# EAGLE design Diversity (EAGLE 6.4)
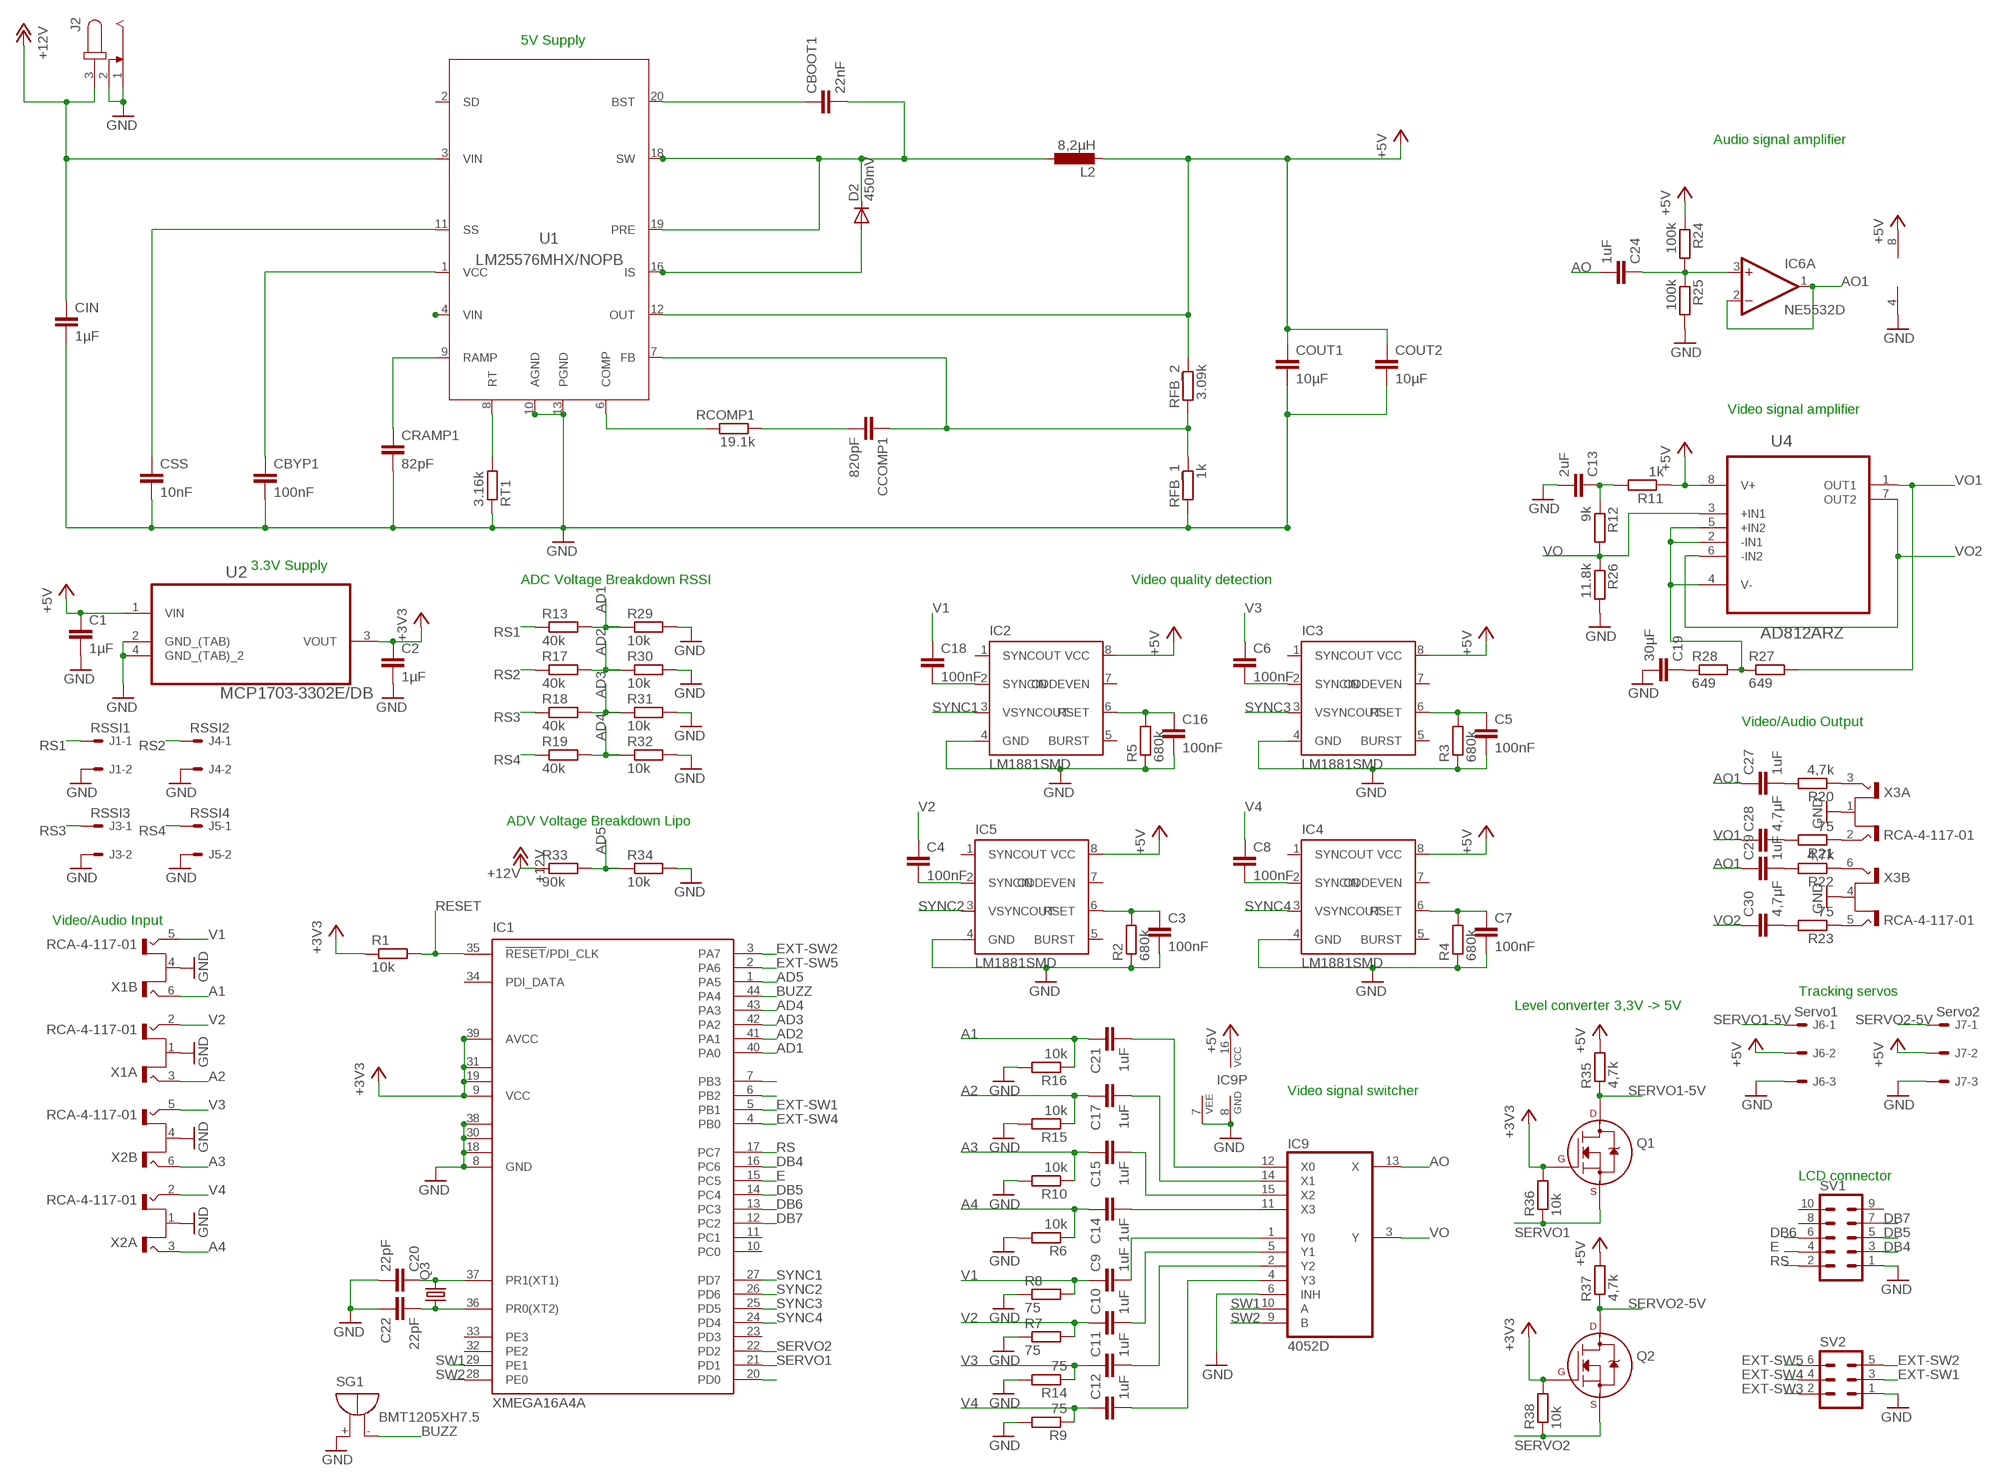
[diagram p0: schematic, sheet 1]

## Parts
C1  1µF  C-EUC0805  [C0805]
C2  1µF  C-EUC0805  [C0805]
C3  100nF  C-EUC0805  [C0805]
C4  100nF  C-EUC0805  [C0805]
C5  100nF  C-EUC0805  [C0805]
C6  100nF  C-EUC0805  [C0805]
C7  100nF  C-EUC0805  [C0805]
C8  100nF  C-EUC0805  [C0805]
C9  1uF  C-EUC0805  [C0805]
C10  1uF  C-EUC0805  [C0805]
C11  1uF  C-EUC0805  [C0805]
C12  1uF  C-EUC0805  [C0805]
C13  2uF  C-EUC0805  [C0805]
C14  1uF  C-EUC0805  [C0805]
C15  1uF  C-EUC0805  [C0805]
C16  100nF  C-EUC0805  [C0805]
C17  1uF  C-EUC0805  [C0805]
C18  100nF  C-EUC0805  [C0805]
C19  30µF  C-EUC0805  [C0805]
C20  22pF  C-EUC0805  [C0805]
C21  1uF  C-EUC0805  [C0805]
C22  22pF  C-EUC0805  [C0805]
C24  1uF  C-EUC0805  [C0805]
C27  1uF  C-EUC0805  [C0805]
C28  4,7µF  C-EUC0805  [C0805]
C29  1uF  C-EUC0805  [C0805]
C30  4,7µF  C-EUC0805  [C0805]
CBOOT1  22nF  C-EUC0805  [C0805]
CBYP1  100nF  C-EUC0805  [C0805]
CCOMP1  820pF  C-EUC0805  [C0805]
CIN  1µF  C-EUC0805  [C0805]
COUT1  10µF  C-EUC0805  [C0805]
COUT2  10µF  C-EUC0805  [C0805]
CRAMP1  82pF  C-EUC0805  [C0805]
CSS  10nF  C-EUC0805  [C0805]
D2  450mV  DIODE-DO214AC  [DO214AC]
IC1  XMEGA16A4A  [TQFP44]
IC2  LM1881SMD  [SOIC08]
IC3  LM1881SMD  [SOIC08]
IC4  LM1881SMD  [SOIC08]
IC5  LM1881SMD  [SOIC08]
IC6  NE5532D  [SO08]
IC9  4052D  [SO16]
J1  RSSI1  22-05-7028-02  [7395-02]
J2  JACK-PLUG0  [SPC4077]
J3  RSSI3  22-05-7028-02  [7395-02]
J4  RSSI2  22-05-7028-02  [7395-02]
J5  RSSI4  22-05-7028-02  [7395-02]
J6  Servo1  22-05-7038-03  [7395-03]
J7  Servo2  22-05-7038-03  [7395-03]
L2  8,2µH  L-EUFPS  [FPS]
Q1  2N7002_SOT23  [SOT-23]
Q2  2N7002_SOT23  [SOT-23]
Q3  CRYSTALHC49UP  [HC49UP]
R1  10k  R-EU_R0805  [R0805@1]
R2  680k  R-EU_R0805  [R0805]
R3  680k  R-EU_R0805  [R0805]
R4  680k  R-EU_R0805  [R0805]
R5  680k  R-EU_R0805  [R0805]
R6  10k  R-EU_M0805  [M0805]
R7  75  R-EU_M0805  [M0805]
R8  75  R-EU_M0805  [M0805]
R9  75  R-EU_M0805  [M0805]
R10  10k  R-EU_M0805  [M0805]
R11  1k  R-EU_R0805  [R0805]
R12  9k  R-EU_R0805  [R0805]
R13  40k  R-EU_R0805  [R0805@1]
R14  75  R-EU_M0805  [M0805]
R15  10k  R-EU_M0805  [M0805]
R16  10k  R-EU_M0805  [M0805]
R17  40k  R-EU_R0805  [R0805@1]
R18  40k  R-EU_R0805  [R0805@1]
R19  40k  R-EU_R0805  [R0805@1]
R20  4,7k  R-EU_R0805  [R0805]
R21  75  R-EU_R0805  [R0805]
R22  4,7k  R-EU_R0805  [R0805]
R23  75  R-EU_R0805  [R0805]
R24  100k  R-EU_R0805  [R0805]
R25  100k  R-EU_R0805  [R0805]
R26  11.8k  R-EU_R0805  [R0805]
R27  649  R-EU_R0805  [R0805]
R28  649  R-EU_R0805  [R0805]
R29  10k  R-EU_R0805  [R0805@1]
R30  10k  R-EU_R0805  [R0805@1]
R31  10k  R-EU_R0805  [R0805@1]
R32  10k  R-EU_R0805  [R0805@1]
R33  90k  R-EU_R0805  [R0805@1]
R34  10k  R-EU_R0805  [R0805@1]
R35  4,7k  R-EU_R0805  [R0805]
R36  10k  R-EU_R0805  [R0805]
R37  4,7k  R-EU_R0805  [R0805]
R38  10k  R-EU_R0805  [R0805]
RCOMP1  19.1k  R-EU_R0805  [R0805]
RFB_1  1k  R-EU_R0805  [R0805]
RFB_2  3.09k  R-EU_R0805  [R0805]
RT1  3.16k  R-EU_R0805  [R0805]
SG1  BMT1205XH7.5  [BMT1205XH7.5]
SV1  ML10  [ML10]
SV2  ML6  [ML6]
U1  LM25576MHX/NOPB  LM25576MHX/NOPBLM25576MHX/NOPB  [MXA20A]
U2  MCP1703-3302E/DB  [SOT230P700X180-4N]
U4  AD812ARZ  [SOIC127P600X175-8N]
X1  RCA-4-117-01  [RCA-4-117-01]
X2  RCA-4-117-01  [RCA-4-117-01]
X3  RCA-4-117-01  [RCA-4-117-01]

## Nets
1: CSS.1 U1.11(SS)
2: CBYP1.1 U1.1(VCC)
3: CRAMP1.1 U1.9(RAMP)
5: RCOMP1.2 U1.6(COMP)
6: CCOMP1.1 RFB_1.1 RFB_2.2 U1.7(FB)
7: CBOOT1.2 D2.C L2.P$1 U1.17(SW) U1.18(SW) U1.19(PRE)
8: D2.A U1.15(IS) U1.16(IS)
11: CBOOT1.1 U1.20(BST)
12: CCOMP1.2 RCOMP1.1
+3V3: C2.1 IC1.9(VCC) IC1.19(VCC1) IC1.31(VCC2) IC1.39(AVCC) Q1.1(G) Q2.1(G) R1.1 R36.2 R38.2 U2.3(VOUT)
+5V: C1.1 COUT1.1 COUT2.1 IC2.8(VCC) IC3.8(VCC) IC4.8(VCC) IC5.8(VCC) IC6.8(P:V+) IC9.16(VCC) J6.2 J7.2 L2.P$2 R11.1 R24.1 R35.2 R37.2 RFB_2.1 U1.12(OUT) U2.1(VIN) U4.8(V+)
+12V: CIN.1 J2.3 R33.1 U1.3(VIN)
A1: C21.1 R16.1 X1.6(B:T2)
A2: C17.1 R15.1 X1.3(A:T2)
A3: C15.1 R10.1 X2.6(B:T2)
A4: C14.1 R6.1 X2.3(A:T2)
AD1: IC1.40(PA0) R13.2 R29.1
AD2: IC1.41(PA1) R17.2 R30.1
AD3: IC1.42(PA2) R18.2 R31.1
AD4: IC1.43(PA3) R19.2 R32.1
AD5: IC1.1(PA5) R33.2 R34.1
AO: C24.2 IC9.13(X)
AO1: C27.1 C29.1 IC6.1(A:OUT) IC6.2(A:-IN)
BUZZ: IC1.44(PA4) SG1.-
DB4: IC1.16(PC6) SV1.3
DB5: IC1.14(PC4) SV1.5
DB6: IC1.13(PC3) SV1.6
DB7: IC1.12(PC2) SV1.7
E: IC1.15(PC5) SV1.4
EXT-SW1: IC1.5(PB1) SV2.3
EXT-SW2: IC1.3(PA7) SV2.5
EXT-SW3: IC1.6(PB2) SV2.2
EXT-SW4: IC1.4(PB0) SV2.4
EXT-SW5: IC1.2(PA6) SV2.6
GND: C1.2 C2.2 C13.2 C19.2 C20.2 C22.1 CBYP1.2 CIN.2 COUT1.2 COUT2.2 CRAMP1.2 CSS.2 IC1.8(GND) IC1.18(GND1) IC1.30(GND2) IC1.38(GND3) IC6.4(P:V-) IC9.6(INH) IC9.7(VEE) IC9.8(GND) J1.2 J2.1 J2.2 J3.2 J4.2 J5.2 J6.3 J7.3 R6.2 R7.1 R8.1 R9.2 R10.2 R14.2 R15.2 R16.2 R25.2 R26.2 R29.2 R30.2 R31.2 R32.2 R34.2 RFB_1.2 RT1.1 SG1.+ SV1.1 SV2.1 U1.10(AGND) U1.13(PGND) U1.14(PGND) U1.21(DAP) U2.2(GND_(TAB)) U2.4(GND_(TAB)_2) X1.1(A:S) X1.4(B:S) X2.1(A:S) X2.4(B:S) X3.1(A:S) X3.4(B:S)
GND1: C3.2 C5.2 C7.2 C16.2 IC2.4(GND) IC3.4(GND) IC4.4(GND) IC5.4(GND) R2.1 R3.1 R4.1 R5.1 ; supply symbol labelled GND
N$1: U1.4(VIN) U1.5(SYNC)
N$2: RT1.2 U1.8(RT)
N$3: C20.1 IC1.37(PR1(XT1)) Q3.2
N$4: C3.1 IC5.6(RSET) R2.2
N$5: C4.2 IC5.2(SYNCIN)
N$6: C5.1 IC3.6(RSET) R3.2
N$7: C6.2 IC3.2(SYNCIN)
N$8: C7.1 IC4.6(RSET) R4.2
N$9: C8.2 IC4.2(SYNCIN)
N$10: C15.2 IC9.15(X2)
N$11: C17.2 IC9.14(X1)
N$12: C9.2 IC9.1(Y0)
N$13: C11.2 IC9.2(Y2)
N$14: C10.2 IC9.5(Y1)
N$15: C21.2 IC9.12(X0)
N$16: C22.2 IC1.36(PR0(XT2)) Q3.1
N$17: C16.1 IC2.6(RSET) R5.2
N$18: C13.1 R11.2 R12.1
N$19: R27.1 R28.2 U4.2(-IN1) U4.4(V-) U4.5(+IN2)
N$22: C18.2 IC2.2(SYNCIN)
N$23: C19.1 R28.1
N$24: IC1.7(PB3)
N$25: C12.2 IC9.4(Y3)
N$28: C14.2 IC9.11(X3)
N$29: IC1.20(PD0)
N$39: R20.1 X3.3(A:T2)
N$40: R21.1 X3.2(A:T1)
N$41: R22.1 X3.6(B:T2)
N$42: R23.1 X3.5(B:T1)
N$43: C27.2 R20.2
N$44: C28.2 R21.2
N$45: C29.2 R22.2
N$46: C30.2 R23.2
N$47: C24.1 IC6.3(A:+IN) R24.2 R25.1
RESET: IC1.35(!RESET!/PDI_CLK) R1.2
RS: IC1.17(PC7) SV1.2
RS1: J1.1 R13.1
RS2: J4.1 R17.1
RS3: J3.1 R18.1
RS4: J5.1 R19.1
SERVO1: IC1.21(PD1) Q1.2(S) R36.1
SERVO1-5V: J6.1 Q1.3(D) R35.1
SERVO2: IC1.22(PD2) Q2.2(S) R38.1
SERVO2-5V: J7.1 Q2.3(D) R37.1
SW1: IC1.29(PE1) IC9.10(A)
SW2: IC1.28(PE0) IC9.9(B)
SYNC1: IC1.27(PD7) IC2.3(VSYNCOUT)
SYNC2: IC1.26(PD6) IC5.3(VSYNCOUT)
SYNC3: IC1.25(PD5) IC3.3(VSYNCOUT)
SYNC4: IC1.24(PD4) IC4.3(VSYNCOUT)
V1: C9.1 C18.1 R8.2 X1.5(B:T1)
V2: C4.1 C10.1 R7.2 X1.2(A:T1)
V3: C6.1 C11.1 R14.1 X2.5(B:T1)
V4: C8.1 C12.1 R9.1 X2.2(A:T1)
VO: IC9.3(Y) R12.2 R26.1 U4.3(+IN1)
VO1: C28.1 R27.2 U4.1(OUT1)
VO2: C30.1 U4.6(-IN2) U4.7(OUT2)
Unconnected: IC1.10(PC0) IC1.11(PC1) IC1.23(PD3) IC1.32(PE2) IC1.33(PE3) IC1.34(PDI_DATA) IC2.1(SYNCOUT) IC2.5(BURST) IC2.7(ODDEVEN) IC3.1(SYNCOUT) IC3.5(BURST) IC3.7(ODDEVEN) IC4.1(SYNCOUT) IC4.5(BURST) IC4.7(ODDEVEN) IC5.1(SYNCOUT) IC5.5(BURST) IC5.7(ODDEVEN) IC6.5(B:+IN) IC6.6(B:-IN) IC6.7(B:OUT) SV1.8 SV1.9 SV1.10 U1.2(SD)

## Notes on the sheet
- 5V Supply
- Audio signal amplifier
- Video signal amplifier
- 3.3V Supply
- ADC Voltage Breakdown RSSI | Video quality detection
- Video/Audio Output
- ADV Voltage Breakdown Lipo
- Video/Audio Input
- Tracking servos
- Level converter 3,3V -> 5V
- Video signal switcher
- LCD connector

## Library data of the parts
C1-C22 C24 C27-C30 CBOOT1 CBYP1 CCOMP1 CIN COUT1 COUT2 CRAMP1 CSS = rcl:C-EU: CAPACITOR, European symbol
D2 = diode:DIODE-: DIODE
IC1 = atmel:XMEGA16A4: MICROCONTROLLER Features High-performance, Low-power 8/16-bit AVR XMEGA Microcontroller Non-Volatile Program and Data Memories - 16 KB - 128 KB of In-System Self-Programmable Flash - 4 KB - 8 KB Boot Code Section with Independent Lock Bits - 1 KB - 2 KB EEPROM - 2 KB - 8 KB Internal SRAM Peripheral Features - Four-channel DMA Controller with support for external requests - Eight-channel Event System - Five 16-bit Timer/Counters Three Timer/Counters with 4 Output Compare or Input Capture channels Two Timer/Counters with 2 Output Compare or Input Capture channels High-Resolution Extensions on all Timer/Counters Advanced Waveform Extension on one Timer/Counter - Five USARTs IrDA Extension on one USART - Two Two-Wire Interfaces with dual address match (I2C and SMBus compatible) - Two SPIs (Serial Peripheral Interfaces) peripherals - AES and DES Crypto Engine - 16-bit Real Time Counter with Separate Oscillator - One Twelve-channel, 12-bit, 2 Msps Analog to Digital Converter - One Two-channel, 12-bit, 1 Msps Digital to Analog Converter - Two Analog Comparators with Window compare function - External Interrupts on all General Purpose I/O pins - Programmable Watchdog Timer with Separate On-chip Ultra Low Power Oscillator Special Microcontroller Features - Power-on Reset and Programmable Brown-out Detection - Internal and External Clock Options with PLL - Programmable Multi-level Interrupt Controller - Sleep Modes: Idle, Power-down, Standby, Power-save, Extended Standby - Advanced Programming, Test and Debugging Interfaces PDI (Program and Debug Interface) for programming, test and debugging I/O and Packages - 34 Programmable I/O Lines - 44 - lead TQFP - 44 - pad VQFN/QFN - 49 - ball VFBGA Operating Voltage - 1.6 - 3.6V Speed performance - 0 - 12 MHz @ 1.6 - 3.6V - 0 - 32 MHz @ 2.7 - 3.6V Drawn by Dipl.-Ing. (FH) Robert Siegler Created: 27.05.09; OC_FARNELL: unknown; OC_NEWARK: unknown
IC2-IC5 = lm1881 (2):LM1881
IC6 = linear:NE5532: AUDIO AMPLIFIER
IC9 = 40xx:4052: Dual 4-channel ANALOG MULTIPLEXER
J1 J3-J5 = con-molex:22-?-02: CONNECTOR wire to board 2.54 mm (.1 inch) pitch header; OC_FARNELL: 9731601; OC_NEWARK: unknown
J2 = con-jack:JACK-PLUG: DC POWER JACK Power Jack, DC, Right Angle, Through Hole, Rated 5A at 16VDC, PC Terminals Distributor: Farnell (www.Farnell.de) Drawing: 84N1161.pdf / 84N1162.pdf Manufacturer: SPC Technology (www.spctechnology.com) Type: SPC4077 / SPC 4078; OC_FARNELL: unknown; OC_NEWARK: unknown
J6 J7 = con-molex:22-?-03: CONNECTOR wire to board 2.54 mm (.1 inch) pitch header; OC_FARNELL: unknown; OC_NEWARK: unknown
L2 = Inductor-Fastron2:L-EU
Q1 Q2 = transistors:2N700*: 2N7000, 2N7002, NDS7002A N-channel enhancement mode MOSFET
Q3 = crystal:CRYSTAL: CRYSTAL; OC_FARNELL: unknown; OC_NEWARK: unknown
R1 R13 R17-R19 R29-R34 = resistor:R-EU_: RESISTOR, European symbol
R2-R12 R14-R16 R20-R28 R35-R38 RCOMP1 RFB_1 RFB_2 RT1 = rcl:R-EU_: RESISTOR, European symbol
SG1 = buzzer:BMT1205XH7.5: MAGNETIC TRANSDUCER Source: Http:www.be-star.com; OC_FARNELL: unknown; OC_NEWARK: unknown
SV1 = con-harting-ml:ML10: HARTING; OC_FARNELL: unknown; OC_NEWARK: unknown
SV2 = con-harting-ml:ML6: HARTING; OC_FARNELL: unknown; OC_NEWARK: unknown
U1 = AcceleratedDesigns_Lib:LM25576MHX/NOPB; DATASHEET_URL: http://www.ti.com/product/lm25576; FREQUENCY: 1000000.0; IMAX: 3.0; MANUFACTURER_NAME: Texas Instruments; MANUFACTURER_PART_NUMBER: LM25576MHX/NOPB; MKTG_PACKAGE: NA; NSID: LM25576MH/NOPB; PACKAGE: NA; VENDOR: Texas Instruments
U2 = Microchip_By_element14_Batch_1:MCP1703-3302E/DB: IC REG LDO 3.3V 250MA; MPN: MCP1703-3302E/DB; OC_FARNELL: 1627177; OC_NEWARK: 40M0623; PACKAGE: SOT-223-3; SUPPLIER: Microchip
U4 = Analog Devices_By_element14_Batch_1:AD812ARZ: Dual, Current Feedback Low Power Op Amp; MPN: AD812ARZ; OC_FARNELL: 1319429; OC_NEWARK: 19M8884; PACKAGE: SOIC-8; SUPPLIER: ANALOG DEVICES
X1-X3 = con-conrad:RCA-4-117-01: Cinch-Anschlussplatte 72385 Gold, Rot, Weiß BKL Electronic Conrad Bestellnummer : 736910 - 62 Source: Data sheet <http://www.produktinfo.conrad.com/datenblaetter/725000-749999/736910-da-01-en-Cinch_Anschlussplatte_4polig.pdf>

## Board
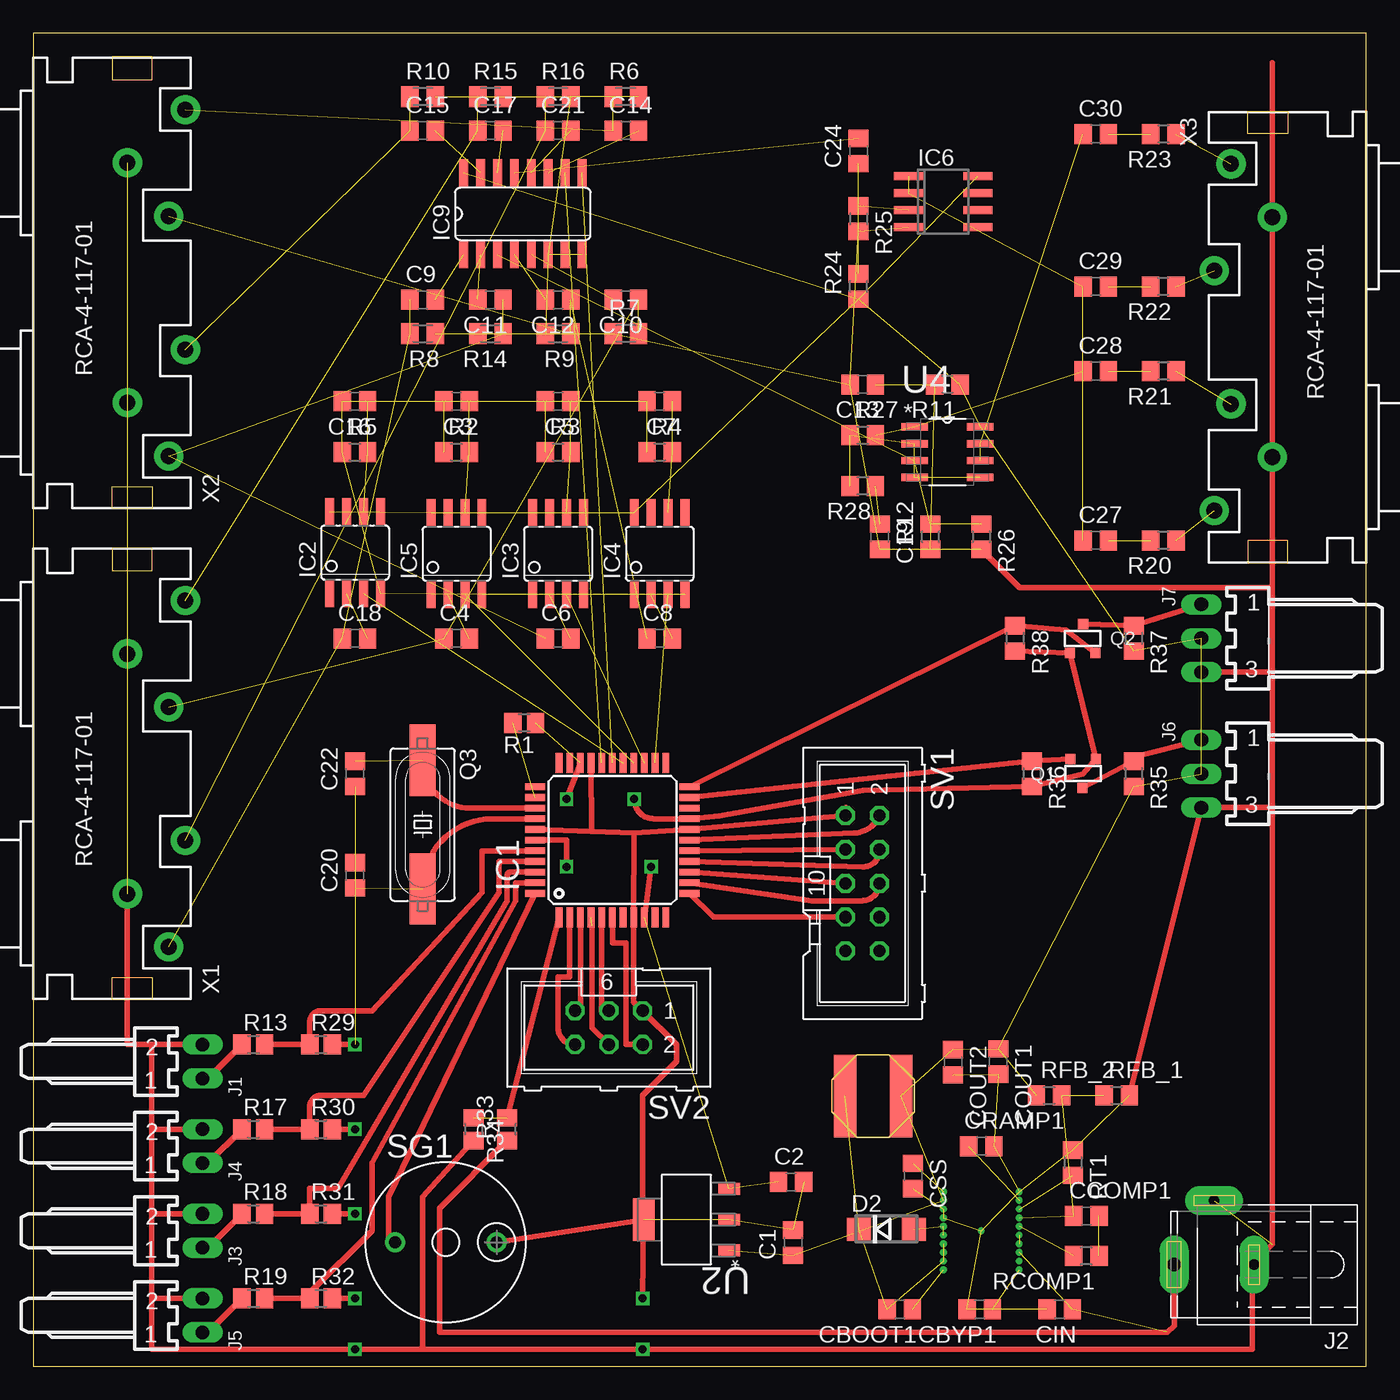
[diagram p1: board, top side]
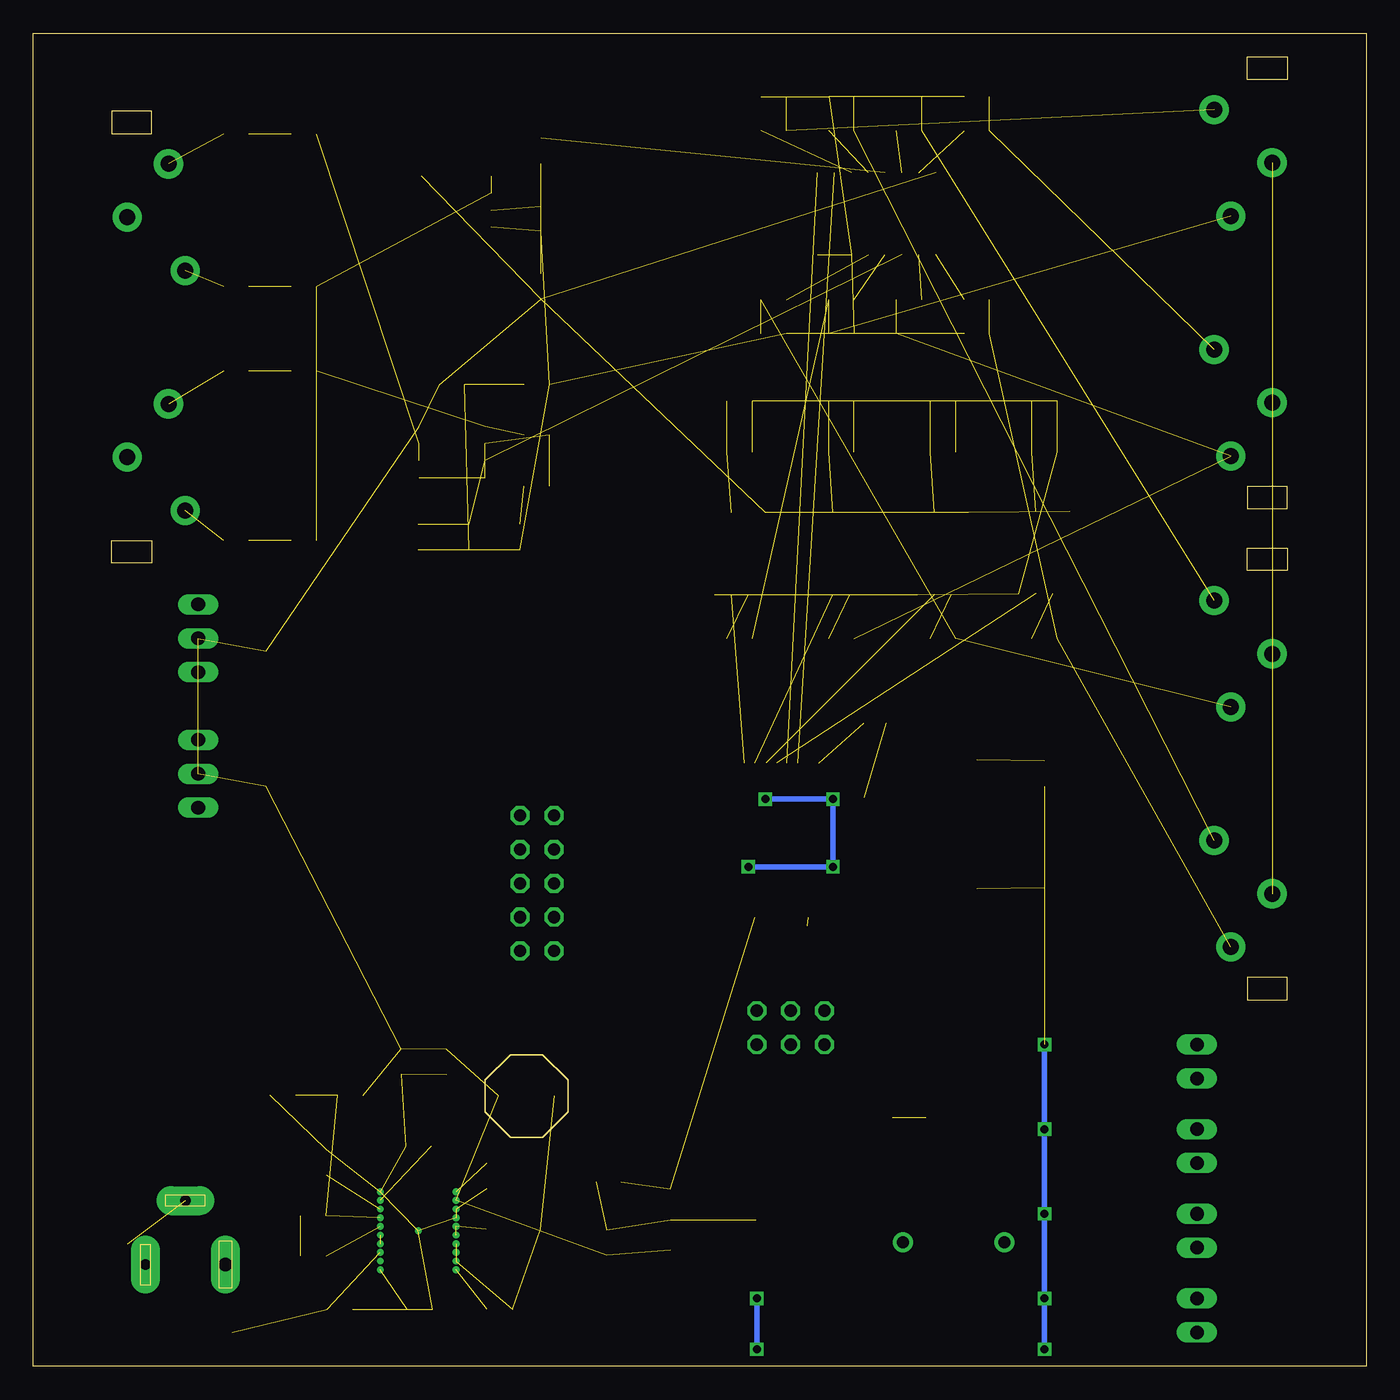
[diagram p2: board, bottom side, seen from below]

Size 100 x 100 mm. Coordinates in mm from the lower left corner, seen from the top.
Outline: 0,0 100,0 100,100 0,100 0,0
Copper layers (1*16): Top 0.035mm / dielectric 1.5mm / Bottom 0.035mm
Design rules "default": minimum track width 10mil, minimum drill 24mil, track to track 8mil, track to pad 8mil, pad to pad 8mil, via to via 8mil, smd to smd 8mil, copper to edge 40mil, drill to drill 8mil, minimum pad ring 10mil, minimum via ring 8mil, stop-mask expansion 4mil, vias tented up to drill 0mil, thermal gap 10mil

### Footprints (pad centres in the part's own frame; a part is rotated, then mirrored left to right if it is on the bottom)
C0805 = smd 1.3 x 1.5: 1 -0.95,0; 2 0.95,0
DO214AC = smd 1.8 x 1.7: A 2.05,0; C -2.05,0
TQFP44 = smd 1.5 x 0.5: 1 -5.8,4; 2 -5.8,3.2; 3 -5.8,2.4; 4 -5.8,1.6; 5 -5.8,0.8; 6 -5.8,0; 7 -5.8,-0.8; 8 -5.8,-1.6; 9 -5.8,-2.4; 10 -5.8,-3.2; 11 -5.8,-4; 23 5.8,-4; 24 5.8,-3.2; 25 5.8,-2.4; 26 5.8,-1.6; 27 5.8,-0.8; 28 5.8,0; 29 5.8,0.8; 30 5.8,1.6; 31 5.8,2.4; 32 5.8,3.2; 33 5.8,4 | smd 0.5 x 1.5: 12 -4,-5.8; 13 -3.2,-5.8; 14 -2.4,-5.8; 15 -1.6,-5.8; 16 -0.8,-5.8; 17 0,-5.8; 18 0.8,-5.8; 19 1.6,-5.8; 20 2.4,-5.8; 21 3.2,-5.8; 22 4,-5.8; 34 4,5.8; 35 3.2,5.8; 36 2.4,5.8; 37 1.6,5.8; 38 0.8,5.8; 39 0,5.8; 40 -0.8,5.8; 41 -1.6,5.8; 42 -2.4,5.8; 43 -3.2,5.8; 44 -4,5.8
SOIC08 = smd 0.66 x 2.032: 1 -1.905,-3.073; 2 -0.635,-3.073; 3 0.635,-3.073; 4 1.905,-3.073; 5 1.905,3.073; 6 0.635,3.073; 7 -0.635,3.073; 8 -1.905,3.073
SO08 = smd 0.6 x 2.2: 1 -1.905,-2.6; 2 -0.635,-2.6; 3 0.635,-2.6; 4 1.905,-2.6; 5 1.905,2.6; 6 0.635,2.6; 7 -0.635,2.6; 8 -1.905,2.6
SO16 = smd 0.66 x 2.032: 1 -4.445,-3.073; 2 -3.175,-3.073; 3 -1.905,-3.073; 4 -0.635,-3.073; 5 0.635,-3.073; 6 1.905,-3.073; 7 3.175,-3.073; 8 4.445,-3.073; 9 4.445,3.073; 10 3.175,3.073; 11 1.905,3.073; 12 0.635,3.073; 13 -0.635,3.073; 14 -1.905,3.073; 15 -3.175,3.073; 16 -4.445,3.073
7395-02 = drill 1.016 long: 1 1.27,0; 2 -1.27,0
SPC4077 = drill 0.8 pad 2.184 long: 1 -3,0; 2 0,-4.8 | drill 1 pad 2.184 long: 3 3,0
7395-03 = drill 1.016 long: 1 2.54,0; 2 0,0; 3 -2.54,0
FPS = smd 1.7 x 6.2: P$1 -2.1,0; P$2 2.1,0
SOT-23 = smd 0.762 x 0.762: 1 -0.979,-1.101; 2 0.94,-1.101; 3 0.025,1.067
HC49UP = smd 5.334 x 1.93: 1 -4.826,0; 2 4.826,0
R0805 = smd 1.3 x 1.5: 1 -0.85,0; 2 0.85,0
R0805' = smd 1.3 x 1.5: 1 -0.95,0; 2 0.95,0
M0805 = smd 1.3 x 1.6: 1 -0.95,0; 2 0.95,0
R0805@1 = smd 1.3 x 1.5: 1 -0.85,0; 2 0.85,0
BMT1205XH7.5 = drill 0.9 pad 1.5: + 3.8,0; - -3.8,0
ML10 = drill 0.914 octagon: 1 -5.08,-1.27; 2 -5.08,1.27; 3 -2.54,-1.27; 4 -2.54,1.27; 5 0,-1.27; 6 0,1.27; 7 2.54,-1.27; 8 2.54,1.27; 9 5.08,-1.27; 10 5.08,1.27
ML6 = drill 0.914 octagon: 1 -2.54,-1.27; 2 -2.54,1.27; 3 0,-1.27; 4 0,1.27; 5 2.54,-1.27; 6 2.54,1.27
MXA20A = drill 0: 1 -2.845,2.925; 2 -2.845,2.275; 3 -2.845,1.625; 4 -2.845,0.975; 5 -2.845,0.325; 6 -2.845,-0.325; 7 -2.845,-0.975; 8 -2.845,-1.625; 9 -2.845,-2.275; 10 -2.845,-2.925; 11 2.845,-2.925; 12 2.845,-2.275; 13 2.845,-1.625; 14 2.845,-0.975; 15 2.845,-0.325; 16 2.845,0.325; 17 2.845,0.975; 18 2.845,1.625; 19 2.845,2.275; 20 2.845,2.925; 21 0,0
SOT230P700X180-4N = smd 1.626 x 0.889: 1 -3.2,2.311; 2 -3.2,0; 3 -3.2,-2.311 | smd 1.626 x 3.175: 4 3.2,0
SOIC127P600X175-8N = smd 1.981 x 0.559: 1 -2.464,1.905; 2 -2.464,0.635; 3 -2.464,-0.635; 4 -2.464,-1.905; 5 2.464,-1.905; 6 2.464,-0.635; 7 2.464,0.635; 8 2.464,1.905
RCA-4-117-01 = drill 1.2 pad 2.184: 1 9,3.1; 2 5,0; 3 13,-1.25; 4 -9,3.1; 5 -13,0; 6 -5,-1.25

### Placement (x,y rotation side)
C1  57,9.27 90 top
C2  56.85,13.82 0 top
C3  31.75,72.39 180 top
C4  31.75,54.61 0 top
C5  39.37,72.39 180 top
C6  39.37,54.61 0 top
C7  46.99,72.39 180 top
C8  46.99,54.61 0 top
C9  29.21,80.01 0 top
C10  44.45,80.01 180 top
C11  34.29,80.01 180 top
C12  39.37,80.01 180 top
C13  62.23,73.66 180 top
C14  44.45,92.71 0 top
C15  29.21,92.71 0 top
C16  24.13,72.39 180 top
C17  34.29,92.71 0 top
C18  24.13,54.61 0 top
C19  63.5,62.23 270 top
C20  24.13,36.83 90 top
C21  39.37,92.71 0 top
C22  24.13,44.45 90 top
C24  61.92,91.17 90 top
C27  79.7,61.96 0 top
C28  79.7,74.66 0 top
C29  79.7,81.01 0 top
C30  79.7,92.44 0 top
CBOOT1  65,4.27 180 top
CBYP1  71,4.27 180 top
CCOMP1  79,11.27 0 top
CIN  77,4.27 180 top
COUT1  72.39,22.86 270 top
COUT2  69,22.81 270 top
CRAMP1  71.12,16.51 0 top
CSS  66,14.27 270 top
D2  64,10.27 0 top
IC1  43.44,39.47 90 top
IC2  24.14,61.05 0 top
IC3  39.37,60.96 0 top
IC4  46.99,60.96 0 top
IC5  31.75,60.96 0 top
IC6  68.27,87.36 270 top
IC9  36.73,86.45 0 top
J1  12.7,22.86 270 top
J2  88.59,7.62 180 top
J3  12.7,10.16 270 top
J4  12.7,16.51 270 top
J5  12.7,3.81 270 top
J6  87.63,44.45 90 top
J7  87.63,54.61 90 top
L2  63,20.27 0 top
Q1  78.74,44.45 180 top
Q2  78.74,54.61 0 top
Q3  29.21,40.64 270 top
R1  10k  [R0805]  36.83,48.26 180 top
R2  680k  [R0805']  31.75,68.58 0 top
R3  680k  [R0805']  39.37,68.58 0 top
R4  680k  [R0805']  46.99,68.58 0 top
R5  680k  [R0805']  24.13,68.58 0 top
R6  44.45,95.25 0 top
R7  44.45,77.47 0 top
R8  29.21,77.47 180 top
R9  39.37,77.47 180 top
R10  29.21,95.25 0 top
R11  1k  [R0805']  68.58,73.66 180 top
R12  9k  [R0805']  67.31,62.23 90 top
R13  16.51,24.13 0 top
R14  34.29,77.47 180 top
R15  34.29,95.25 0 top
R16  39.37,95.25 0 top
R17  16.51,17.78 0 top
R18  16.51,11.43 0 top
R19  16.51,5.08 0 top
R20  4,7k  [R0805']  84.78,61.96 180 top
R21  75  [R0805']  84.78,74.66 180 top
R22  4,7k  [R0805']  84.78,81.01 180 top
R23  75  [R0805']  84.78,92.44 180 top
R24  100k  [R0805']  61.92,81.01 90 top
R25  100k  [R0805']  61.92,86.09 270 top
R26  11.8k  [R0805']  71.12,62.23 270 top
R27  649  [R0805']  62.23,69.85 0 top
R28  649  [R0805']  62.23,66.04 180 top
R29  21.59,24.13 0 top
R30  21.59,17.78 0 top
R31  21.59,11.43 0 top
R32  21.59,5.08 0 top
R33  35.56,17.78 90 top
R34  33.02,17.78 270 top
R35  4,7k  [R0805']  82.55,44.45 270 top
R36  10k  [R0805']  74.93,44.45 270 top
R37  4,7k  [R0805']  82.55,54.61 270 top
R38  10k  [R0805']  73.66,54.61 270 top
RCOMP1  19.1k  [R0805']  79,8.27 180 top
RFB_1  1k  [R0805']  81.28,20.32 0 top
RFB_2  3.09k  [R0805']  76.2,20.32 0 top
RT1  3.16k  [R0805']  78,15.27 270 top
SG1  30.94,9.29 0 top
SV1  62.21,36.23 270 top
SV2  43.18,25.4 180 top
U1  71.12,10.16 180 top
U2  49,11 180 top
U4  68.58,68.58 0 top
X1  10.16,44.45 90 top
X2  10.16,81.28 90 top
X3  89.86,77.2 270 top

### Tracks (layer width: path | path; a pad name or v marks a point on that pad's centre or on a via)
1  (1 unrouted)
2  (1 unrouted)
3  (1 unrouted)
5  (1 unrouted)
6  (3 unrouted)
7  (5 unrouted)
8  (2 unrouted)
11  (1 unrouted)
12  (1 unrouted)
+3V3  (via drill 0.6)  (3 unrouted)
  Top 0.406: IC1.31 v40.01,42.55 | v40.01,37.47 40.01,39.47 IC1.39 | v45.09,42.55 arc90 46.56,41.07 IC1.19 51.44,41.27 62.23,43.18 R36.2 78.74,44.45 Q1.1 Q2.1 R38.2 | v46.35,37.47 IC1.9
  Bottom 0.406: v45.09,42.55 v40.01,42.55 v40.01,37.47 v46.35,37.47
+5V  (19 unrouted)
+12V  (2 unrouted)
  Top 0.406: R33.1 30.48,11.85 30.48,2.54 85.09,2.54 85.59,3.04 J2.3
A1  (2 unrouted)
A2  (2 unrouted)
A3  (2 unrouted)
A4  (2 unrouted)
AD1
  Top 0.406: R13.2 R29.1 20.74,25.82 arc-90 21.59,26.67 25.4,26.67 33.66,35.56 33.66,38.67 IC1.40
AD2
  Top 0.406: R17.2 R30.1 20.74,19.47 arc-90 21.59,20.32 24.77,20.32 34.92,35.56 34.92,37.87 IC1.41
AD3
  Top 0.406: R18.2 R31.1 20.74,13.34 22.86,13.34 35.56,34.92 35.56,36.83 arc-90 35.8,37.07 IC1.42
AD4
  Top 0.406: R19.2 R32.1 20.74,5.5 25.4,10.16 25.4,15.24 36.2,34.92 36.2,36.27 IC1.43
AD5  (1 unrouted)
  Top 0.406: IC1.1 R33.2
AO  (1 unrouted)
AO1  (3 unrouted)
BUZZ
  Top 0.406: SG1.- 26.67,9.29 26.67,12.7 IC1.44
DB4
  Top 0.406: IC1.16 SV1.3
DB5
  Top 0.406: IC1.14 SV1.5
DB6
  Top 0.406: IC1.13 58.42,34.92 62.17,34.92 arc90 SV1.6
DB7
  Top 0.406: IC1.12 51.02,33.69 SV1.7
E
  Top 0.406: IC1.15 62.23,37.47 arc96 SV1.4
EXT-SW1
  Top 0.406: IC1.5 42.64,26.67 SV2.3
EXT-SW2
  Top 0.406: SV2.5 arc90 41.04,27.07 IC1.3
EXT-SW3
  Top 0.406: SV2.2 44.45,24.13 44.45,31.75 43.44,31.75 IC1.6
EXT-SW4  (1 unrouted)
  Top 0.406: SV2.4 41.91,25.4 41.91,33.02
EXT-SW5
  Top 0.406: SV2.6 arc-90 39.37,25.4 39.37,29.21 40.24,29.21 IC1.2
GND  (via drill 0.6)  (35 unrouted)
  Top 0.406: 92.96,58.42 X3.1 X3.4 92.96,97.79 | 92.96,58.42 92.96,52.07 | 92.96,52.07 J7.3 | 92.96,41.91 J6.3 RFB_1.2 | 92.96,41.91 92.96,52.07 | R34.2 29.21,12.7 29.21,1.27 | 29.21,1.27 v45.72,1.27 91.44,1.27 91.44,7.62 | 91.44,7.62 J2.1 | SG1.+ U2.4 | 92.96,58.42 73.98,58.42 R26.2 71.12,60.96 | U2.4 arc-90 45.72,11.08 45.72,20.32 48.26,22.86 48.26,24.13 SV2.1 45.04,27.35 IC1.8 45.09,40.01 | 45.09,40.01 IC1.18 SV1.1 60.96,41.91 | 45.09,40.01 41.89,40.12 | 41.89,40.12 IC1.38 | IC1.30 41.89,40.12 | 91.44,7.62 92.96,9.14 92.96,41.91 | U2.4 v45.72,5.08 | 8.89,5.08 8.89,1.27 v24.13,1.27 29.21,1.27 | J5.2 8.89,5.08 | 8.89,5.08 8.89,11.43 | J3.2 8.89,11.43 | 8.89,11.43 8.89,17.78 | J4.2 8.89,17.78 | 8.89,17.78 8.89,24.13 J1.2 7.06,24.13 X1.4 | R32.2 v24.13,5.08 | R31.2 v24.13,11.43 | R30.2 v24.13,17.78 | R29.2 v24.13,24.13
  Bottom 0.406: v45.72,5.08 arc2 v45.72,1.27 | v24.13,1.27 v24.13,5.08 v24.13,11.43 v24.13,17.78 v24.13,24.13
GND1  (11 unrouted)
N$1  (1 unrouted)
N$2  (1 unrouted)
N$3  (1 unrouted)
  Top 0.406: IC1.37 34.47,41.07 arc90 Q3.2
N$4  (2 unrouted)
N$5  (1 unrouted)
N$6  (2 unrouted)
N$7  (1 unrouted)
N$8  (2 unrouted)
N$9  (1 unrouted)
N$10  (1 unrouted)
N$11  (1 unrouted)
N$12  (1 unrouted)
N$13  (1 unrouted)
N$14  (1 unrouted)
N$15  (1 unrouted)
N$16  (1 unrouted)
  Top 0.406: IC1.36 32.81,41.87 arc-90 Q3.1
N$17  (2 unrouted)
N$18  (2 unrouted)
N$19  (4 unrouted)
N$20  (via drill 0.6)
  other vias: 40.01,42.55
N$21  (via drill 0.6)
  other vias: 45.09,42.55
N$22  (1 unrouted)
N$23  (1 unrouted)
N$25  (1 unrouted)
N$26  (via drill 0.6)
  other vias: 46.35,37.47
N$27  (via drill 0.6)
  other vias: 40.01,37.47
N$28  (1 unrouted)
N$30  (via drill 0.6)
  other vias: 45.72,5.08
N$31  (via drill 0.6)
  other vias: 24.13,5.08
N$32  (via drill 0.6)
  other vias: 24.13,11.43
N$33  (via drill 0.6)
  other vias: 24.13,17.78
N$34  (via drill 0.6)
  other vias: 24.13,24.13
N$39  (1 unrouted)
N$40  (1 unrouted)
N$41  (1 unrouted)
N$42  (1 unrouted)
N$43  (1 unrouted)
N$44  (1 unrouted)
N$45  (1 unrouted)
N$46  (1 unrouted)
N$47  (3 unrouted)
RESET  (1 unrouted)
RS
  Top 0.406: IC1.17 61.59,40.01 arc64 SV1.2
RS1
  Top 0.406: J1.1 13.12,21.59 R13.1
RS2
  Top 0.406: J4.1 13.12,15.24 R17.1
RS3
  Top 0.406: J3.1 13.12,8.89 R18.1
RS4
  Top 0.406: J5.1 13.12,2.54 R19.1
SERVO1
  Top 0.406: IC1.21 R36.1 Q1.2
SERVO1-5V
  Top 0.406: Q1.3 R35.1 82.55,45.72 J6.1
SERVO2
  Top 0.406: IC1.22 R38.1 77.47,55.24 Q2.2
SERVO2-5V
  Top 0.406: Q2.3 R37.1 J7.1
SW1  (1 unrouted)
SW2  (1 unrouted)
SYNC1  (1 unrouted)
SYNC2  (1 unrouted)
SYNC3  (1 unrouted)
SYNC4  (1 unrouted)
V1  (3 unrouted)
V2  (3 unrouted)
V3  (3 unrouted)
V4  (3 unrouted)
VO  (3 unrouted)
VO1  (2 unrouted)
VO2  (2 unrouted)